# Altium schematic sheet 13_LED_BACKLIGHT.SchDoc: =TitleParameter
size A3; Address: Crete IL; Organization: ASISGUARD; Address1: Kemalpasa, Kemalpasa Cd. No:290 D:292H, 35060 Bornova/Izmir/Turkey
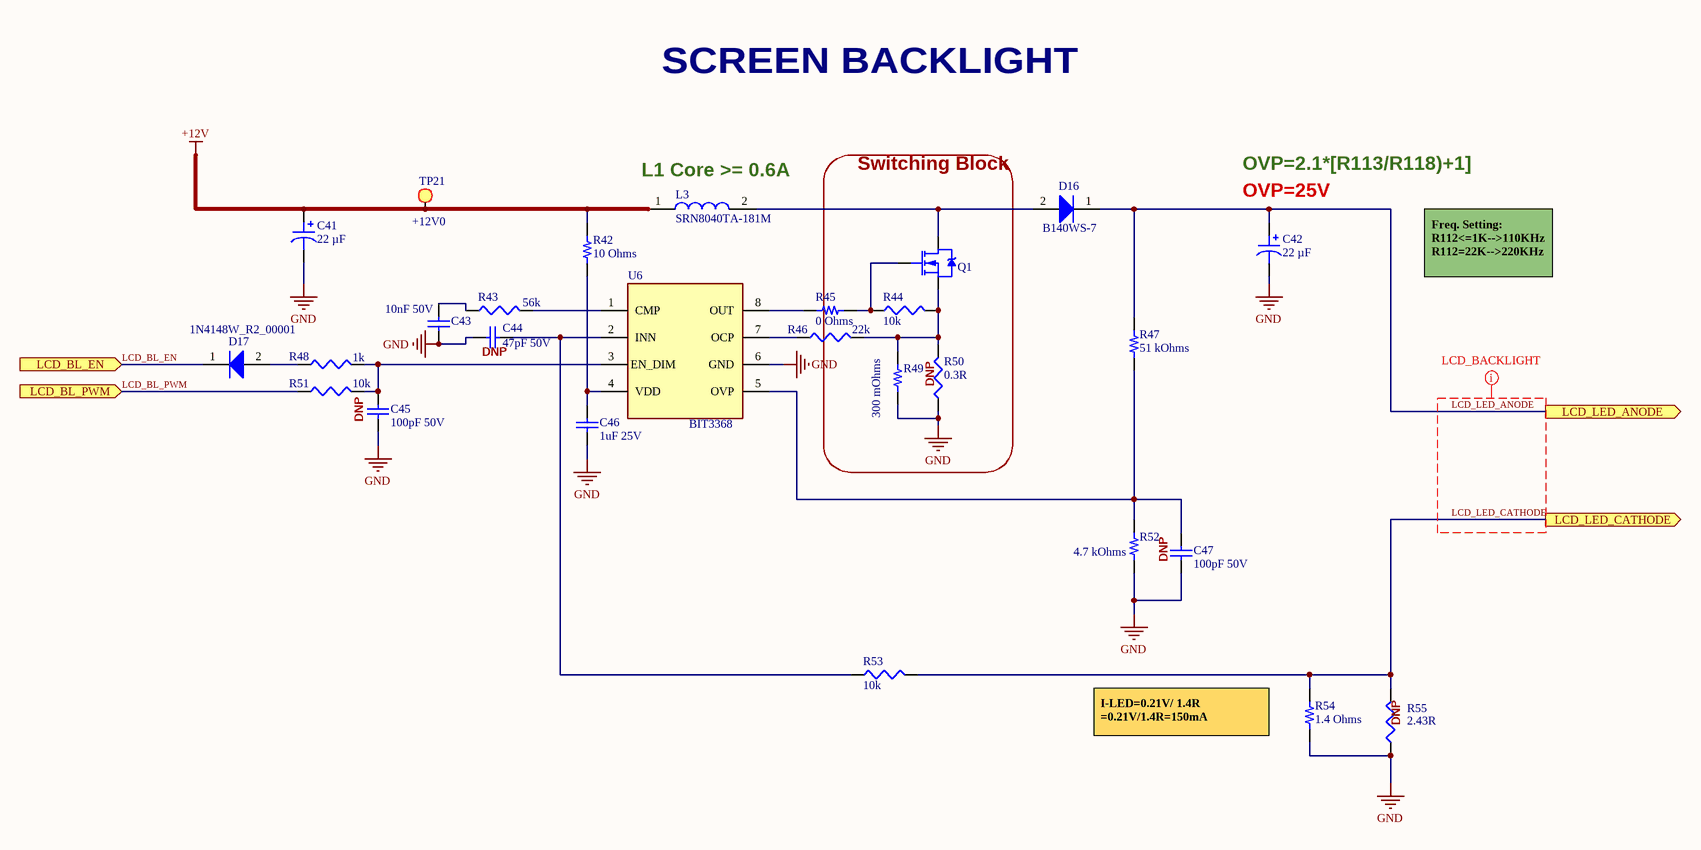
[diagram p0: 13_LED_BACKLIGHT.SchDoc]

## Parts
C41  22 µF  [CAP ALSMD 6.6MM H5.4MM]
C42  22 µF  [CAP ALSMD 6.6MM H5.4MM]
C43  value 10nF 50V  [SMC0603]  (hidden comment: CAP CER 10000PF 50V X7R 0603)
C44  value 47pF 50V  [SMC0603]  (hidden comment: CAP CER 47PF 50V C0G/NPO 0603)
C45  value 100pF 50V  [SMC0603]  (hidden comment: CAP CER 100PF 50V C0G/NP0 0603)
C46  value 1uF 25V  [SMC0603]  (hidden comment: CAP CER 1UF 25V X5R 0603)
C47  value 100pF 50V  [SMC0603]  (hidden comment: CAP CER 100PF 50V C0G/NP0 0603)
D16  Manufacturer Part Number: B140WS-7  [SOD-323_L1.8-W1.3-LS2.5-RD]  (hidden comment: DIODE SCHOTTKY 40V 1A SOD323)
D17  Diode 75 V 200mA Surface Mount SOD-123  [SOD-123_L2.8-W1.8-LS3.7-RD]  (value not drawn)
L3  SRN8040TA-181M  [INDPM8080X450N]
Q1  MOSFET N-CH 100V 30A TO252-3  [TO-252_L6.5-W6.1-P4.58-LS9.9-BR]  (value not drawn)
R42  10 Ohms  [RES 0805_2012]
R43  value 56k  [SMR0603]  (hidden comment: RES 56K OHM 1% 1/10W 0603)
R44  value 10k  [SMR0603]  (hidden comment: RES 10K OHM 1% 1/10W 0603)
R45  0 Ohms  [RES 0603_1608]
R46  value 22k  [SMR0603]  (hidden comment: RES 22K OHM 1% 1/10W 0603)
R47  51 kOhms  [RES 0603_1608]
R48  value 1k  [SMR0603]  (hidden comment: RES 1K OHM 1% 1/10W 0603)
R49  300 mOhms  [RES 0805_2012]
R50  value 0.3R  [SMR0805]  (hidden comment: 125mW Thick Film Resistors ±1% 300mΩ 0805 Chip Resistor - Surface Mount ROHS)
R51  value 10k  [SMR0603]  (hidden comment: RES 10K OHM 1% 1/10W 0603)
R52  4.7 kOhms  [RES 0603_1608]
R53  value 10k  [SMR0603]  (hidden comment: RES 10K OHM 1% 1/10W 0603)
R54  1.4 Ohms  [RES 0805_2012]
R55  value 2.43R  [SMR0805]  (hidden comment: 125mW Thick Film Resistors ±1% 2.43Ω 0805 Chip Resistor - Surface Mount ROHS)
TP21  +12V0  [TEST_POINT]
U6  BIT3368 LED DRIVER CONTROLLER  [SOP-8_L4.9-W3.9-P1.27-LS6.0-BL]  (value not drawn)

## Blocks framed on the sheet
Switching Block: Q1 R44-R46 R49 R50

## Ports
LCD_BL_EN (in), LCD_BL_PWM (in), LCD_LED_ANODE (out), LCD_LED_CATHODE (out)

## Nets
+12V: C41.1 L3.1 R42.2 TP21.1(TP)
GND: C41.2 C42.2 C43.1 C44.1 C45.1 C46.1 C47.1 R49.1 R50.1 R52.1 R54.1 R55.1 U6.6(GND)
LCD_BL_EN: D17.1(K) ; port LCD_BL_EN
LCD_BL_PWM: R51.1 ; port LCD_BL_PWM
LCD_LED_ANODE: C42.1 D16.1(K) R47.2 ; port LCD_LED_ANODE
LCD_LED_CATHODE: R53.2 R54.2 R55.2 ; port LCD_LED_CATHODE
NetC43_2: C43.2 R43.1
NetC44_2: C44.2 R53.1 U6.2(INN)
NetC45_2: C45.2 R48.2 R51.2 U6.3(EN_DIM)
NetC46_2: C46.2 R42.1 U6.4(VDD)
NetC47_2: C47.2 R47.1 R52.2 U6.5(OVP)
NetD16_2: D16.2(A) L3.2 Q1.2(D)
NetD17_2: D17.2(A) R48.1
NetQ1_1: Q1.1(G) R44.1 R45.2
NetQ1_3: Q1.3(S) R44.2 R46.2 R49.2 R50.2
NetR43_2: R43.2 U6.1(CMP)
NetR45_1: R45.1 U6.8(OUT)
NetR46_1: R46.1 U6.7(OCP)

## Layout directives
net class LCD_BACKLIGHT: LCD_LED_ANODE, LCD_LED_CATHODE

## Notes on the sheet
- SCREEN BACKLIGHT
- (near L3) L1 Core >= 0.6A
- OVP=2.1*[R113/R118)+1]
- (near C42) OVP=25V
- Freq. Setting:
  R112<=1K-->110KHz
  R112=22K-->220KHz
- (near C44) DNP
- DNP
- (near R50) DNP
- (near C47) DNP
- (near R54) I-LED=0.21V/ 1.4R
  =0.21V/1.4R=150mA
- (near R55) DNP
- Proje/Project:
- Sayfa Adı/Document Name:
- Çizilme Tarihi/Drawing Date
- Umit KAYACIK
- Tasarlayan/Designed By
- Sayfa/Sheet:
- Revision:
- of
- Son Güncelleme/Last Edit Date
- Kontrol eden/Checked By
- Onaylayan/Approved By
- Boyut/Size:
- Varyant/Variant:
- Dil/Language:
- A3
- ENG

## Library data of the parts
C41 C42 = 865080643008: CAP ALUM 22UF 20% 50V SMD; manufacturer: Würth Elektronik; Impedance: 1.3 Ohms; Lifetime @ Temp.: 2000 Hrs @ 105°C; Polarization: Polar; Ripple Current @ High Frequency: 150 mA @ 100 kHz; Ripple Current @ Low Frequency: 97.5 mA @ 120 Hz; Surface Mount Land Size: 0.260" L x 0.260" W (6.60mm x 6.60mm); Part Number: 865080643008; Applications: General Purpose; Capacitance: 22 µF; componentlink1description: Datasheet; componentlink1url: https://katalog.we-online.de/pbs/datasheet/865080643008.pdf; componentlink2description: DigiKey Link; componentlink2url: https://www.digikey.com/en/products/detail/würth-elektronik/865080643008/5728048; Device Package: Radial, Can - SMD; Height - Seated (Max): 0.217" (5.50mm); lastupdated: 3/11/2024 7:45:23 AM; Lifecycle Status: Active; Minimum Order: 1; Mounting Type: Surface Mount; Operating Temperature: -55°C ~ 105°C; Package / Case: Radial, Can - SMD; packaging: TapeAndReel; partid: 8986; Part Status: Active; price: 0.15; series: WCAP-ASLI; Size / Dimension: 0.248" Dia (6.30mm); Supplier 1: DigiKey; Supplier Part Number 1: 732-8453-1-ND; Tolerance: ±20%; value: 22 µF; Voltage - Rated: 50 V
C43 = CAP0603_10NF_50V: 10000 pF ±10% 50V Ceramic Capacitor X7R 0603 (1608 Metric); Manufacturer Part Number: CL10B103KB8NNNC; Order Code: DIGI : 1276-1009-2-ND; LCSC Manufacturer Part Number: CL10B103KB8NNNC; LCSC Part Number: C1589
C44 = CAP0603_47PF_50V: 47 pF ±5% 50V Ceramic Capacitor C0G, NP0 0603 (1608 Metric); Manufacturer Part Number: CC0603JRNPO9BN470; Order Code: DIGI : 311-1065-2-ND; LCSC Manufacturer Part Number: CC0603JRNPO9BN470; LCSC Part Number: C105622
C45 C47 = CAP0603_100PF_50V: 100 pF ±5% 50V Ceramic Capacitor C0G, NP0 0603 (1608 Metric); Manufacturer Part Number: 06035A101JAT2A; LCSC Manufacturer Part Number: CC0603JRNPO9BN101; Order Code: DIGI: 478-1175-2-ND; Sirius Stock Code: *; LCSC Part Number: C14665
C46 = CAP0603_1UF_50V: 1 µF ±10% 25V Ceramic Capacitor X5R 0603 (1608 Metric); Manufacturer Part Number: CL10A105KA8NNNC; Order Code: Digi: 1276-1102-2-ND; Sirius Stock Code: *; LCSC Part Number: C5673; LCSC Manufacturer Part Number: CL10A105KA8NNNC
D16 = BS140WS-7: Diode 40 V 1A Surface Mount SOD-323; Order Code: Digi: B140WS-7DITR-ND; LCSC Manufacturer Part Number: B140WS-7; LCSC Part Number: C95171
D17 = 1N4148W_R2_00001: Manufacturer Part Number: 1N4148W_R2_00001
L3 = SRN8040TA-181M: FIXED IND 180UH 910MA 490MOHM SM; Manufacturer_Name: Bourns; Datasheet Link: http://www.bourns.com/docs/Product-Datasheets/SRN8040TA.pdf; Height: 4.5mm; Manufacturer_Part_Number: SRN8040TA-181M; Mouser Part Number: 652-SRN8040TA-181M; Mouser Price/Stock: https://www.mouser.co.uk/ProductDetail/Bourns/SRN8040TA-181M?qs=Vt59ZOdFuWYBehGVtqRu4w%3D%3D; Arrow Part Number: SRN8040TA-181M; Arrow Price/Stock: https://www.arrow.com/en/products/srn8040ta-181m/bourns?region=nac
Q1 = IPD30N10S3L34ATMA1: N-Channel 100 V 30A (Tc) 57W (Tc) Surface Mount PG-TO252-3-11; Manufacturer Part Number: IPD30N10S3L34ATMA1; Value: N-Channel 100 V 30A (Tc) 57W (Tc) Surface Mount PG-TO252-3-11
R42 = MCU08050C1009FP500: RES SMD 10 OHM 1% 1/5W 0805; Manufacturer: Vishay Beyschlag; Power (Watts): 0.2W, 1/5W; Temperature Coefficient: ±50ppm/°C; Part Number: MCU08050C1009FP500; Value: 10 Ohms; ComponentLink1Description: Datasheet; ComponentLink1URL: http://www.vishay.com/docs/28705/mcx0x0xpro.pdf; ComponentLink2Description: DigiKey Link; ComponentLink2URL: http://digikey.com/product-detail/en/vishay-beyschlag/MCU08050C1009FP500/749-1723-1-ND/7348031; Composition: Thin Film; Device Package: 0805 (2012 Metric); Features: Anti-Sulfur; Height - Seated (Max): 0.022" (0.55mm); LastUpdated: 2/8/2024 9:02:08 PM; Lifecycle Status: Active; Minimum Order: 1; Number of Terminations: 2; Operating Temperature: -55°C ~ 155°C; Package / Case: 0805 (2012 Metric); Packaging: TapeAndReel; PartId: 34857; Part Status: Active; Price: 0.07; Resistance: 10 Ohms; Series: MCU - Professional; Size / Dimension: 0.079" L x 0.049" W (2.00mm x 1.25mm); Supplier 1: DigiKey; Supplier Part Number 1: 749-1723-1-ND; Supplier Device Package: 0805; Tolerance: ±1%
R43 = RES0603_56K_%1: 56 kOhms ±1% 0.1W, 1/10W Chip Resistor 0603 (1608 Metric) Moisture Resistant Thick Film; Manufacturer Part Number: RC0603FR-0756KL; Order Code: Digi: 311-56KHRTR-ND; Sirius Stock Code: *; LCSC Part Number: C114630; LCSC Manufacturer Part Number: RC0603FR-0756KL
R44 R51 R53 = RES0603_10K_%1: 10 kOhms ±1% 0.1W, 1/10W Chip Resistor 0603 (1608 Metric) Moisture Resistant Thick Film; Manufacturer Part Number: RC0603FR-0710KL; Order Code: Digi: 311-10.0KHRTR-ND; Sirius Stock Code: *; LCSC Part Number: C98220; LCSC Manufacturer Part Number: RC0603FR-0710KL
R45 = RC0603JR-070RL: RES 0 OHM JUMPER 1/10W 0603; Manufacturer: Yageo; Power (Watts): 0.1W, 1/10W; Part Number: RC0603JR-070RL; Value: 0 Ohms; ComponentLink1Description: Datasheet; ComponentLink1URL: https://www.yageo.com/upload/media/product/productsearch/datasheet/rchip/PYu-RC_Group_51_RoHS_L_10.pdf; ComponentLink2Description: DigiKey Link; ComponentLink2URL: https://www.digikey.com/en/products/detail/yageo/RC0603JR-070RL/726675; Composition: Thick Film; Device Package: 0603 (1608 Metric); Features: Moisture Resistant; Height - Seated (Max): 0.022" (0.55mm); LastUpdated: 2/9/2024 8:42:27 PM; Lifecycle Status: Active; Minimum Order: 1; Number of Terminations: 2; Operating Temperature: -55°C ~ 155°C; Package / Case: 0603 (1608 Metric); Packaging: CutTape; PartId: 22595; Part Status: Active; Price: 0.01; Resistance: 0 Ohms; Series: RC_L; Size / Dimension: 0.063" L x 0.031" W (1.60mm x 0.80mm); Supplier 1: DigiKey; Supplier Part Number 1: 311-0.0GRCT-ND; Supplier Device Package: 0603; Tolerance: Jumper
R46 = RES0603_22K_%1: 22K; Manufacturer Part Number: RC0603FR-0722KL; Order Code: Digi: 311-22.0KHRTR-ND; Sirius Stock Code: *; LCSC Part Number: C114065; LCSC Manufacturer Part Number: RC0603FR-0722KL
R47 = CRCW060351K0FKEA: RES SMD 51K OHM 1% 1/10W 0603; Manufacturer: Vishay Dale; Power (Watts): 0.1W, 1/10W; Temperature Coefficient: ±100ppm/°C; Part Number: CRCW060351K0FKEA; Value: 51 kOhms; ComponentLink1Description: Datasheet; ComponentLink1URL: http://www.vishay.com/docs/20035/dcrcwe3.pdf; ComponentLink2Description: DigiKey Link; ComponentLink2URL: https://www.digikey.com/en/products/detail/vishay-dale/CRCW060351K0FKEA/1174862; Composition: Thick Film; Device Package: 0603 (1608 Metric); Features: Automotive AEC-Q200; Height - Seated (Max): 0.020" (0.50mm); LastUpdated: 2/9/2024 8:43:25 PM; Lifecycle Status: Active; Minimum Order: 1; Number of Terminations: 2; Operating Temperature: -55°C ~ 155°C; Package / Case: 0603 (1608 Metric); Packaging: TapeAndReel; PartId: 7831; Part Status: Active; Price: 0.01; Ratings: AEC-Q200; Resistance: 51 kOhms; Series: CRCW; Size / Dimension: 0.061" L x 0.033" W (1.55mm x 0.85mm); Supplier 1: DigiKey; Supplier Part Number 1: 541-51.0KHCT-ND; Supplier Device Package: 0603; Tolerance: ±1%
R48 = RES0603_1K_%1: 1 kOhms ±1% 0.1W, 1/10W Chip Resistor 0603 (1608 Metric) Moisture Resistant Thick Film; Manufacturer Part Number: RC0603FR-071KL; Order Code: Digi: 311-1.00KHRTR-ND; Sirius Stock Code: *; LCSC Part Number: C22548; LCSC Manufacturer Part Number: RC0603FR-071KL
R49 = CSR0805FKR300: RES 0.3 OHM 1% 1/4W 0805; Manufacturer: Stackpole Electronics Inc; Power (Watts): 0.25W, 1/4W; Temperature Coefficient: ±200ppm/°C; Part Number: CSR0805FKR300; Value: 300 mOhms; ComponentLink1Description: Datasheet; ComponentLink1URL: https://www.seielect.com/catalog/sei-csr_csrn.pdf; ComponentLink2Description: DigiKey Link; ComponentLink2URL: https://www.digikey.com/en/products/detail/stackpole-electronics-inc/CSR0805FKR300/1742448; Composition: Thick Film; Device Package: 0805 (2012 Metric); Features: Current Sense; Height - Seated (Max): 0.026" (0.65mm); LastUpdated: 2/8/2024 9:02:29 PM; Lifecycle Status: Active; Minimum Order: 1; Number of Terminations: 2; Operating Temperature: -55°C ~ 155°C; Package / Case: 0805 (2012 Metric); Packaging: TapeAndReel; PartId: 29999; Part Status: Active; Price: 0.05; Resistance: 300 mOhms; Series: CSR; Size / Dimension: 0.079" L x 0.049" W (2.00mm x 1.25mm); Supplier 1: DigiKey; Supplier Part Number 1: CSR0805FKR300CT-ND; Supplier Device Package: 0805; Tolerance: ±1%
R50 = RES0805_0.3R_%1: Manufacturer Part Number: 0805W8F300LT5E; Order Code: LCSC: C247157; LCSC Manufacturer Part Number: 0805W8F300LT5E; LCSC Part Number: C247157
R52 = ERA-3AEB472V: RES SMD 4.7K OHM 0.1% 1/10W 0603; Manufacturer: Panasonic Electronic Components; Power (Watts): 0.1W, 1/10W; Temperature Coefficient: ±25ppm/°C; Part Number: ERA-3AEB472V; Value: 4.7 kOhms; ComponentLink1Description: Datasheet; ComponentLink1URL: https://industrial.panasonic.com/cdbs/www-data/pdf/RDM0000/AOA0000C307.pdf; ComponentLink2Description: DigiKey Link; ComponentLink2URL: https://www.digikey.com/en/products/detail/panasonic-electronic-components/ERA-3AEB472V/1465870; Composition: Thin Film; Device Package: 0603 (1608 Metric); Features: Automotive AEC-Q200; Height - Seated (Max): 0.022" (0.55mm); LastUpdated: 2/9/2024 8:43:34 PM; Lifecycle Status: Active; Minimum Order: 1; Number of Terminations: 2; Operating Temperature: -55°C ~ 155°C; Package / Case: 0603 (1608 Metric); Packaging: TapeAndReel; PartId: 5519; Part Status: Active; Price: 0.03; Ratings: AEC-Q200; Resistance: 4.7 kOhms; Series: ERA-3A; Size / Dimension: 0.063" L x 0.031" W (1.60mm x 0.80mm); Supplier 1: DigiKey; Supplier Part Number 1: P4.7KDBCT-ND; Supplier Device Package: 0603; Tolerance: ±0.1%
R54 = RK73H2ATTD1R40F: RES 1.4 OHM 1% 1/4W 0805; Manufacturer: KOA Speer Electronics, Inc.; Power (Watts): 0.25W, 1/4W; Temperature Coefficient: ±200ppm/°C; Part Number: RK73H2ATTD1R40F; Value: 1.4 Ohms; ComponentLink1Description: Datasheet; ComponentLink1URL: https://www.koaspeer.com/pdfs/RK73H.pdf; ComponentLink2Description: DigiKey Link; ComponentLink2URL: https://www.digikey.com/en/products/detail/koa-speer-electronics-inc/RK73H2ATTD1R40F/10228601; Composition: Thick Film; Device Package: 0805 (2012 Metric); Features: Automotive AEC-Q200, Moisture Resistant; Height - Seated (Max): 0.024" (0.60mm); LastUpdated: 2/8/2024 9:00:36 PM; Lifecycle Status: Active; Minimum Order: 1; Number of Terminations: 2; Operating Temperature: -55°C ~ 155°C; Package / Case: 0805 (2012 Metric); Packaging: TapeAndReel; PartId: 61343; Part Status: Active; Price: 0.01; Ratings: AEC-Q200; Resistance: 1.4 Ohms; Series: RK73H; Size / Dimension: 0.079" L x 0.049" W (2.00mm x 1.25mm); Supplier 1: DigiKey; Supplier Part Number 1: 2019-RK73H2ATTD1R40FCT-ND; Supplier Device Package: 0805; Tolerance: ±1%
R55 = RES0805_2R43_%1: Manufacturer Part Number: FRC0805F2R43TS; Order Code: LCSC: C2933405; LCSC Manufacturer Part Number: FRC0805F2R43TS; LCSC Part Number: C2933405
TP21 = TP_1
U6 = BIT3368: High Performance PWM Controller; Manufacturer: BITEK; LSCS Part Number: C5252694; Manufacturer Part Number: BIT3368